# Altium project 底板.PrjPCB
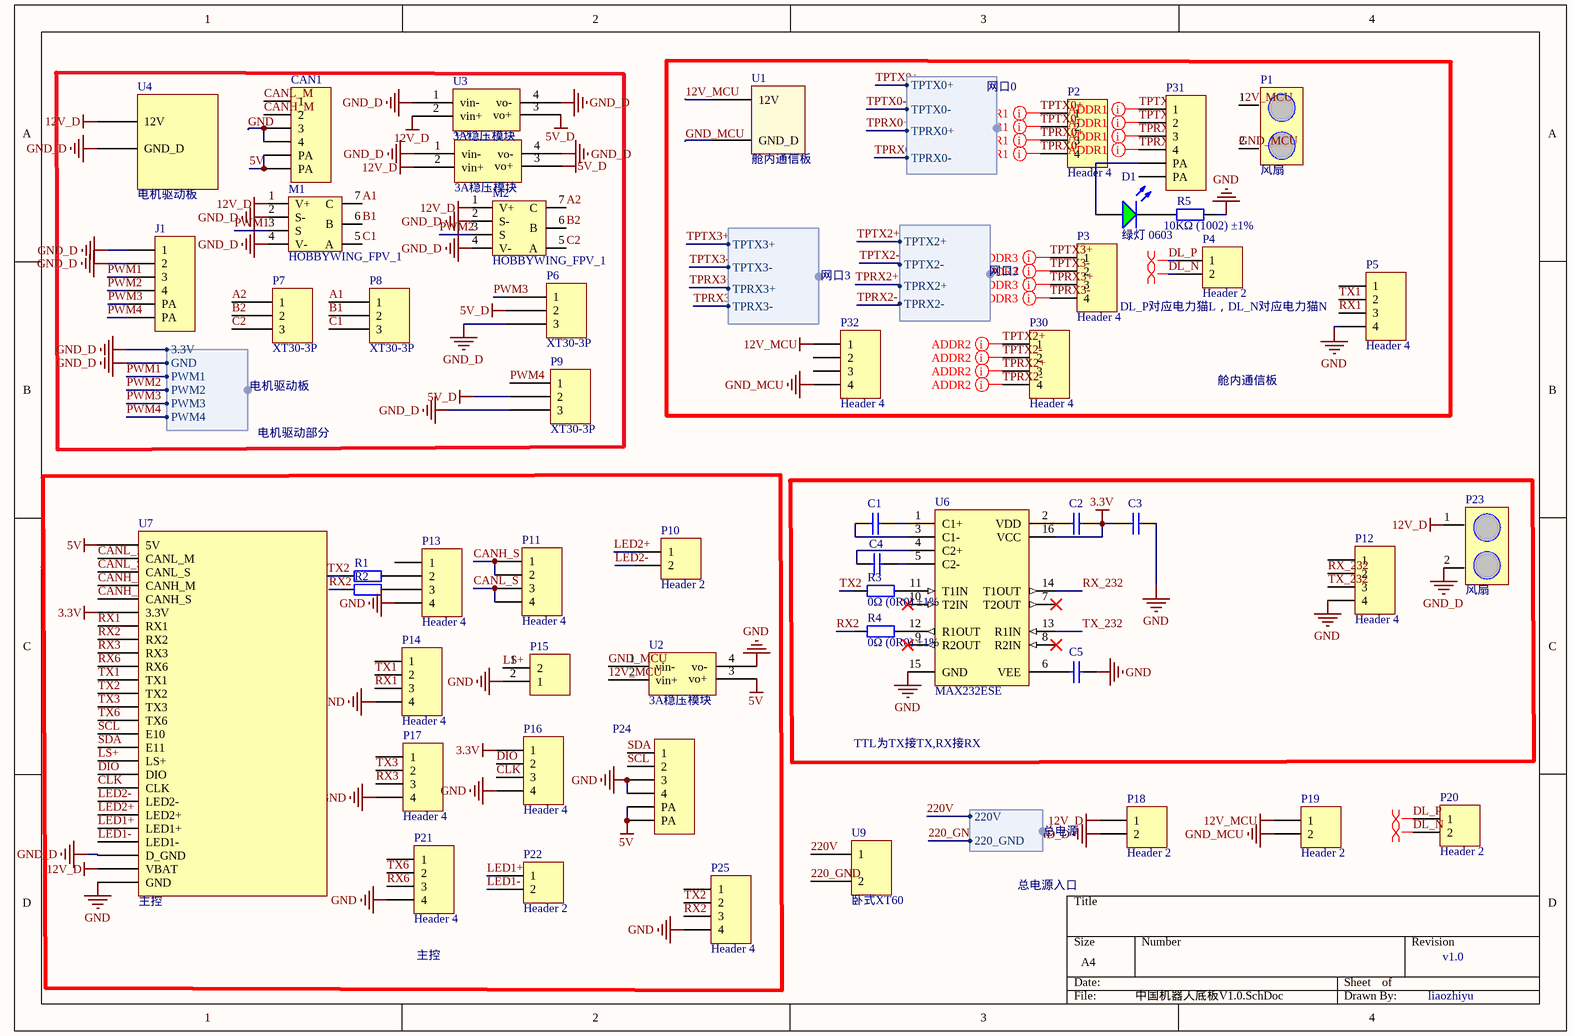
[diagram p0: 中国机器人底板V1.0.SchDoc]
1 sheet, 51 parts. Net scope: global (net labels, ports and power ports of the same name join across sheets).
Board file: 底板.PcbDoc

## Sheet 中国机器人底板V1.0.SchDoc
size A4

### Parts
C1  100nF (104) 10% 50V  [0603_C]  (value not drawn)
C2  100nF (104) 10% 50V  [0603_C]  (value not drawn)
C3  100nF (104) 10% 50V  [0603_C]  (value not drawn)
C4  100nF (104) 10% 50V  [0603_C]  (value not drawn)
C5  100nF (104) 10% 50V  [0603_C]  (value not drawn)
CAN1  Header 6  [Modolex_6P]  (value not drawn)
D1  绿灯 0603  [0603_LED_S1]
J1  Header 6  [Modolex_6P]  (value not drawn)
M1  HOBBYWING_FPV_1  [HOBBYWING_WING20A/30A]
M2  HOBBYWING_FPV_1  [HOBBYWING_WING20A/30A]
P1  风扇  [风扇接口]
P2  Header 4  [Molex-4]
P3  Header 4  [Molex-4]
P4  Header 2  [XT30 - 2]
P5  Header 4  [Molex-4]
P6  XT30-3P  [XT30-3P]
P7  XT30-3P  [XT30-3P]
P8  XT30-3P  [XT30-3P]
P9  XT30-3P  [XT30-3P]
P10  Header 2  [XT30 - 2]
P11  Header 4  [Molex-4]
P12  Header 4  [Molex-4]
P13  Header 4  [Molex-4]
P14  Header 4  [Molex-4]
P15  Header 2  [XT30 - 2]  (value not drawn)
P16  Header 4  [Molex-4]
P17  Header 4  [Molex-4]
P18  Header 2  [XT30 - 2]
P19  Header 2  [XT30 - 2]
P20  Header 2  [XT30 - 2]
P21  Header 4  [Molex-4]
P22  Header 2  [XT30 - 2]
P23  风扇  [风扇接口]
P24  Header 6  [Modolex_6P]  (value not drawn)
P25  Header 4  [Molex-4]
P30  Header 4  [Molex-4]
P31  Header 6  [Modolex_6P]  (value not drawn)
P32  Header 4  [Molex-4]
R1  0Ω (0R0) ±1%  [0603_R]  (value not drawn)
R2  0Ω (0R0) ±1%  [0603_R]  (value not drawn)
R3  0Ω (0R0) ±1%  [0603_R]
R4  0Ω (0R0) ±1%  [0603_R]
R5  10KΩ (1002) ±1%  [0603_R]
U1  舱内通信板  [舱内通信板]
U2  3A稳压模块  [稳压模块]
U3  3A稳压模块  [稳压模块]
U4  电机驱动板  [电机驱动板]
U5  3A稳压模块  [稳压模块]
U6  MAX232ESE  [SOIC-16_150mil]
U7  主控  [主控]
U9  卧式XT60  [卧式XT60]

### Blocks framed on the sheet
电机驱动部分: CAN1 J1 M1 M2 P6-P9 U3-U5
TTL为TX接TX,RX接RX: C1-C5 P12 P23 R3 R4 U6

### Harnesses
电机驱动板: 3.3V, GND, PWM1, PWM2, PWM3, PWM4
网口2: TPTX2+, TPTX2-, TPRX2+, TPRX2-
网口0: TPTX0+, TPTX0-, TPRX0+, TPRX0-
网口3: TPTX3+, TPTX3-, TPRX3+, TPRX3-
总电源: 220V, 220_GND

### Nets
3.3V: C2.2 C3.1 P16.1 U6.16(VCC) U7.6(3.3V)
5V: CAN1.5(PA) CAN1.6(PA) P24.5(PA) P24.6(PA) U2.3(vo+) U7.1(5V)
5V_D: P6.2 P9.2 U3.3(vo+) U5.3(vo+)
12V_D: M1.1(V+) M2.1(V+) P18.1 P23.1 U3.2(vin+) U4.1(12V) U5.2(vin+) U7.25(VBAT)
12V_MCU: P1.1 P19.1 P32.1 U1.1(12V) U2.2(vin+)
GND: C3.2 C5.2 CAN1.3 CAN1.4 P5.4 P12.4 P13.4 P14.4 P15.2(1) P16.4 P17.4 P21.4 P24.3 P24.4 P25.4 R5.2 U2.4(vo-) U6.15(GND) U7.26(GND)
GND_D: J1.1 J1.2 M1.2(S-) M1.4(V-) M2.2(S-) M2.4(V-) P6.3 P9.3 P18.2 P23.2 U3.1(vin-) U3.4(vo-) U4.2(GND_D) U5.1(vin-) U5.4(vo-) U7.24(D_GND) ; harness 电机驱动板.3.3V, harness 电机驱动板.GND
GND_MCU: P1.2 P19.2 P32.4 U1.2(GND_D) U2.1(vin-)
220_GND: U9.2 ; harness 总电源.220_GND
220V: U9.1 ; harness 总电源.220V
A1: M1.7(C) P8.1
A2: M2.7(C) P7.1
B1: M1.6(B) P8.2
B2: M2.6(B) P7.2
C1: M1.5(A) P8.3
C2: M2.5(A) P7.3
CANH_M: CAN1.2 U7.4(CANH_M)
CANH_S: P11.1 P11.2 U7.5(CANH_S)
CANL_M: CAN1.1 U7.2(CANL_M)
CANL_S: P11.3 P11.4 U7.3(CANL_S)
CLK: P16.3 U7.19(CLK)
DIO: P16.2 U7.18(DIO)
DL_N: P4.2 P20.2
DL_P: P4.1 P20.1
LED1+: P22.1 U7.22(LED1+)
LED1-: P22.2 U7.23(LED1-)
LED2+: P10.1 U7.21(LED2+)
LED2-: P10.2 U7.20(LED2-)
LS+: P15.1(2) U7.17(LS+)
PWM1: J1.3 M1.3(S) ; harness 电机驱动板.PWM1
PWM2: J1.4 M2.3(S) ; harness 电机驱动板.PWM2
PWM3: J1.5(PA) P6.1 ; harness 电机驱动板.PWM3
PWM4: J1.6(PA) P9.1 ; harness 电机驱动板.PWM4
RX1: P5.3 P14.3 U7.7(RX1)
RX2: P25.3 R2.1 R4.1 U7.8(RX2)
RX3: P17.3 U7.9(RX3)
RX6: P21.3 U7.10(RX6)
RX_232: P12.2 U6.14(T1OUT)
SCL: P24.2 U7.15(E10)
SDA: P24.1 U7.16(E11)
TPRX0+: P2.3 P31.3 ; harness 网口0.TPRX0+
TPRX0-: P2.4 P31.4 ; harness 网口0.TPRX0-
TPRX2+: P30.3 ; harness 网口2.TPRX2+
TPRX2-: P30.4 ; harness 网口2.TPRX2-
TPRX3+: P3.3 ; harness 网口3.TPRX3+
TPRX3-: P3.4 ; harness 网口3.TPRX3-
TPTX0+: P2.1 P31.1 ; harness 网口0.TPTX0+
TPTX0-: P2.2 P31.2 ; harness 网口0.TPTX0-
TPTX2+: P30.1 ; harness 网口2.TPTX2+
TPTX2-: P30.2 ; harness 网口2.TPTX2-
TPTX3+: P3.1 ; harness 网口3.TPTX3+
TPTX3-: P3.2 ; harness 网口3.TPTX3-
TX1: P5.2 P14.2 U7.11(TX1)
TX2: P25.2 R1.1 R3.1 U7.12(TX2)
TX3: P17.2 U7.13(TX3)
TX6: P21.2 U7.14(TX6)
TX_232: P12.3 U6.13(R1IN)
NetC1_1: C1.1 U6.3(C1-)
NetC1_2: C1.2 U6.1(C1+)
NetC2_1: C2.1 U6.2(VDD)
NetC4_1: C4.1 U6.4(C2+)
NetC4_2: C4.2 U6.5(C2-)
NetC5_1: C5.1 U6.6(VEE)
NetD1_A: D1.A P31.5(PA)
NetD1_K: D1.K R5.1
NetP13_2: P13.2 R1.2
NetP13_3: P13.3 R2.2
NetR3_2: R3.2 U6.11(T1IN)
NetR4_2: R4.2 U6.12(R1OUT)

Not connected (* = marked no-connect by the designer): P5 1; P12 1; P13 1; P14 1; P17 1; P21 1; P25 1; P31 6(PA); P32 2 3; U6 7(T2OUT)* 8(R2IN)* 9(R2OUT)* 10(T2IN)*

### Layout directives
mark named ADDR1: TPRX0+, TPRX0-, TPTX0+, TPTX0-
mark named ADDR3: TPRX3+, TPRX3-, TPTX3+, TPTX3-
differential pair: DL_N, DL_P
mark named ADDR2: TPRX2+, TPRX2-, TPTX2+, TPTX2-

### Notes on the sheet
- DL_P对应电力猫L，DL_N对应电力猫N
- 舱内通信板
- 总电源入口
- (near P21) 主控
- v1.0
- liaozhiyu

### Library data of the parts
C1-C5 = 0603 100nF (104) 10% 50V: 贴片电容; ComponentLink1Description: 供应商链接; ComponentLink1URL: http://www.szlcsc.com/product/details_15331.html; Package: 0603; Supplier: LC; SuppliersPartNumber: C14663
CAN1 J1 P24 P31 = Header 6: Header, 6-Pin; LatestRevisionDate: 17-Jul-2002; LatestRevisionNote: Re-released for DXP Platform.; Publisher: Altium Limited
D1 = 0603 绿灯: 发光二极管; ComponentLink1Description: 供应商链接; ComponentLink1URL: http://www.szlcsc.com/product/details_73152.html; Package: 0603; Supplier: LC; SuppliersPartNumber: C72043
P2 P3 P5 P11-P14 P16 P17 P21 P25 P30 P32 = Header 4: Header, 4-Pin; LatestRevisionDate: 17-Jul-2002; LatestRevisionNote: Re-released for DXP Platform.; Publisher: Altium Limited
P4 P10 P15 P18-P20 P22 = Header 2: Header, 2-Pin; LatestRevisionDate: 17-Jul-2002; LatestRevisionNote: Re-released for DXP Platform.; Publisher: Altium Limited
R1-R4 = 0603 0Ω (0R0) 1%: 贴片电阻; ComponentLink1Description: 供应商链接; ComponentLink1URL: http://www.szlcsc.com/product/details_21903.html; Package: 0603; Supplier: LC; SuppliersPartNumber: C21189
R5 = 0603 10KΩ (1002) 1%: 贴片电阻; ComponentLink1Description: 供应商链接; ComponentLink1URL: http://www.szlcsc.com/product/details_26547.html; Package: 0603; Supplier: LC; SuppliersPartNumber: C25804
U2 U3 U5 = 可调稳压芯片
U6 = MAX232ESE_[C26860]: RS232; ComponentLink1Description: 供应商链接; ComponentLink1URL: http://www.szlcsc.com/product/details_27608.html; Package: SOIC-16_150mil; Supplier: LC; SuppliersPartNumber: C26860